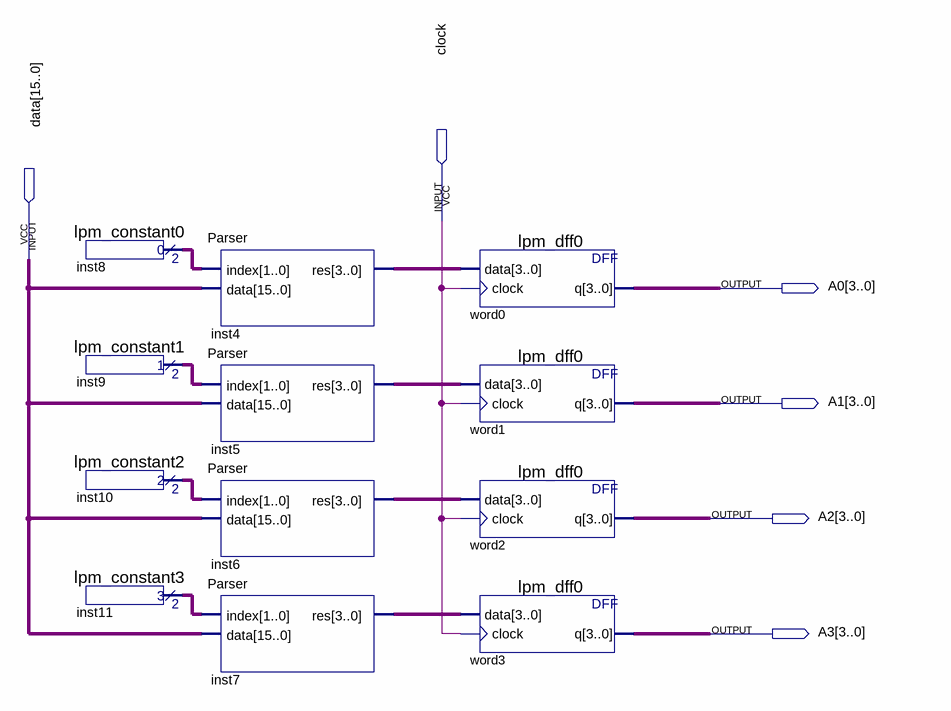
[diagram p0: schematic sheet]
// Quartus schematic RON.bdf as structural Verilog: 12 symbols, 6 pins
module RON (
  input  clock,
  input  [15:0] data,
  output [3:0] A0,
  output [3:0] A1,
  output [3:0] A2,
  output [3:0] A3
);

  wire [1:0] inst8_result, inst9_result, inst10_result, inst11_result;
  wire [3:0] inst4_res, inst5_res, inst6_res, inst7_res;

  lpm_constant0 inst8 (.result(inst8_result));
  lpm_constant1 inst9 (.result(inst9_result));
  lpm_constant2 inst10 (.result(inst10_result));
  lpm_constant3 inst11 (.result(inst11_result));
  Parser inst4 (.index(inst8_result), .data(data), .res(inst4_res));
  Parser inst5 (.index(inst9_result), .data(data), .res(inst5_res));
  Parser inst6 (.index(inst10_result), .data(data), .res(inst6_res));
  Parser inst7 (.index(inst11_result), .data(data), .res(inst7_res));
  lpm_dff0 word0 (.data(inst4_res), .clock(clock), .q(A0));
  lpm_dff0 word1 (.data(inst5_res), .clock(clock), .q(A1));
  lpm_dff0 word2 (.data(inst6_res), .clock(clock), .q(A2));
  lpm_dff0 word3 (.data(inst7_res), .clock(clock), .q(A3));
endmodule
